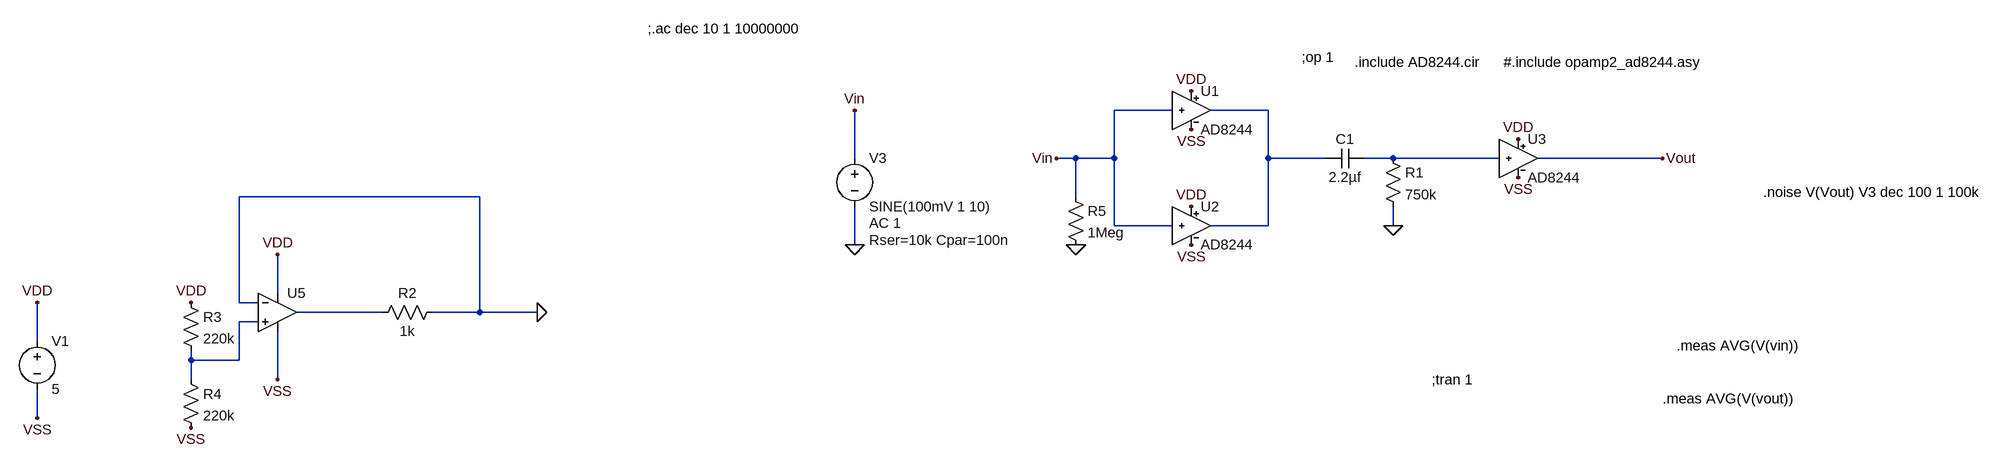
[diagram p0: schematic eegfilt.asc]
eegfilt.asc, the LTspice schematic file:
Version 4
SHEET 1 1268 748
WIRE -96 -16 -192 -16
WIRE 64 -16 -32 -16
WIRE -624 64 -624 -16
WIRE -256 64 -288 64
WIRE -192 64 -192 -16
WIRE -192 64 -256 64
WIRE 64 64 64 -16
WIRE 160 64 64 64
WIRE 272 64 224 64
WIRE 448 64 272 64
WIRE 720 64 512 64
WIRE -1248 128 -1648 128
WIRE -256 128 -256 64
WIRE -192 176 -192 64
WIRE -96 176 -192 176
WIRE 64 176 64 64
WIRE 64 176 -32 176
WIRE 272 176 272 144
WIRE -624 208 -624 144
WIRE -1584 288 -1584 224
WIRE -1648 304 -1648 128
WIRE -1616 304 -1648 304
WIRE -1408 320 -1552 320
WIRE -1248 320 -1248 128
WIRE -1248 320 -1328 320
WIRE -1152 320 -1248 320
WIRE -1616 336 -1648 336
WIRE -1984 368 -1984 304
WIRE -1728 400 -1728 384
WIRE -1648 400 -1648 336
WIRE -1648 400 -1728 400
WIRE -1728 432 -1728 400
WIRE -1584 432 -1584 352
WIRE -1984 496 -1984 448
FLAG -64 -48 VDD
FLAG -64 144 VDD
FLAG 480 32 VDD
FLAG -64 16 VSS
FLAG -64 208 VSS
FLAG 480 96 VSS
FLAG 272 176 0
FLAG -288 64 Vin
FLAG 720 64 Vout
FLAG -624 208 0
FLAG -624 -16 Vin
FLAG -1152 320 0
FLAG -1584 224 VDD
FLAG -1584 432 VSS
FLAG -1728 512 VSS
FLAG -1728 304 VDD
FLAG -1984 304 VDD
FLAG -1984 496 VSS
FLAG -256 208 0
SYMBOL opamp2_ad8244 -64 -80 R0
SYMATTR InstName U1
SYMATTR Value AD8244
SYMBOL cap 224 48 R90
WINDOW 0 0 32 VBottom 2
WINDOW 3 32 32 VTop 2
SYMATTR InstName C1
SYMATTR Value 2.2µf
SYMBOL res 256 48 R0
SYMATTR InstName R1
SYMATTR Value 750k
SYMBOL opamp2_ad8244 -64 112 R0
SYMATTR InstName U2
SYMATTR Value AD8244
SYMBOL opamp2_ad8244 480 0 R0
SYMATTR InstName U3
SYMATTR Value AD8244
SYMBOL voltage -624 48 R0
WINDOW 123 24 124 Left 2
WINDOW 39 24 152 Left 2
SYMATTR Value2 AC 1
SYMATTR SpiceLine Rser=10k Cpar=100n
SYMATTR InstName V3
SYMATTR Value SINE(100mV 1 10)
SYMBOL res -1312 304 R90
WINDOW 0 0 56 VBottom 2
WINDOW 3 32 56 VTop 2
SYMATTR InstName R2
SYMATTR Value 1k
SYMBOL res -1744 288 R0
SYMATTR InstName R3
SYMATTR Value 220k
SYMBOL res -1744 416 R0
SYMATTR InstName R4
SYMATTR Value 220k
SYMBOL voltage -1984 352 R0
WINDOW 123 0 0 Left 2
WINDOW 39 0 0 Left 2
SYMATTR InstName V1
SYMATTR Value 5
SYMBOL Opamps\\UniversalOpamp2 -1584 320 R0
SYMATTR InstName U5
SYMBOL res -272 112 R0
SYMATTR InstName R5
SYMATTR Value 1Meg
TEXT 208 -96 Left 2 !.include AD8244.cir
TEXT 456 -96 Left 2 !#.include opamp2_ad8244.asy
TEXT 120 -104 Left 2 !;op 1
TEXT 336 432 Left 2 !;tran 1
TEXT 720 464 Left 2 !.meas AVG(V(vout))
TEXT 744 376 Left 2 !.meas AVG(V(vin))
TEXT -968 -152 Left 2 !;.ac dec 10 1 10000000
TEXT 888 120 Left 2 !.noise V(Vout) V3 dec 100 1 100k

The netlist it stands for:
* eegfilt.asc
XU1 Vin VDD VSS N001 AD8244  ; pins Vin +Vs -Vs Vout
C1 N002 N001 2.2µf
R1 N002 0 750k
XU2 Vin VDD VSS N001 AD8244  ; pins Vin +Vs -Vs Vout
XU3 N002 VDD VSS Vout AD8244  ; pins Vin +Vs -Vs Vout
V3 Vin 0 SINE(100mV 1 10) AC 1 Rser=10k Cpar=100n
R2 0 N003 1k
R3 VDD N004 220k
R4 N004 VSS 220k
V1 VDD VSS 5
XU5 N004 0 VDD VSS N003 level.2 Avol=1Meg GBW=10Meg Slew=10Meg ilimit=25m rail=0 Vos=0 phimargin=45 en=0 enk=0 in=0 ink=0 Rin=500Meg  ; pins IN+ IN- V+ V- OUT
R5 Vin 0 1Meg
.include AD8244.cir
#.include opamp2_ad8244.asy
;op 1
;tran 1
.meas AVG(V(vout))
.meas AVG(V(vin))
;.ac dec 10 1 10000000
.noise V(Vout) V3 dec 100 1 100k
.lib UniversalOpamps2.sub
.backanno
.end